# EAGLE design adamonv2 (EAGLE 6.5.0)
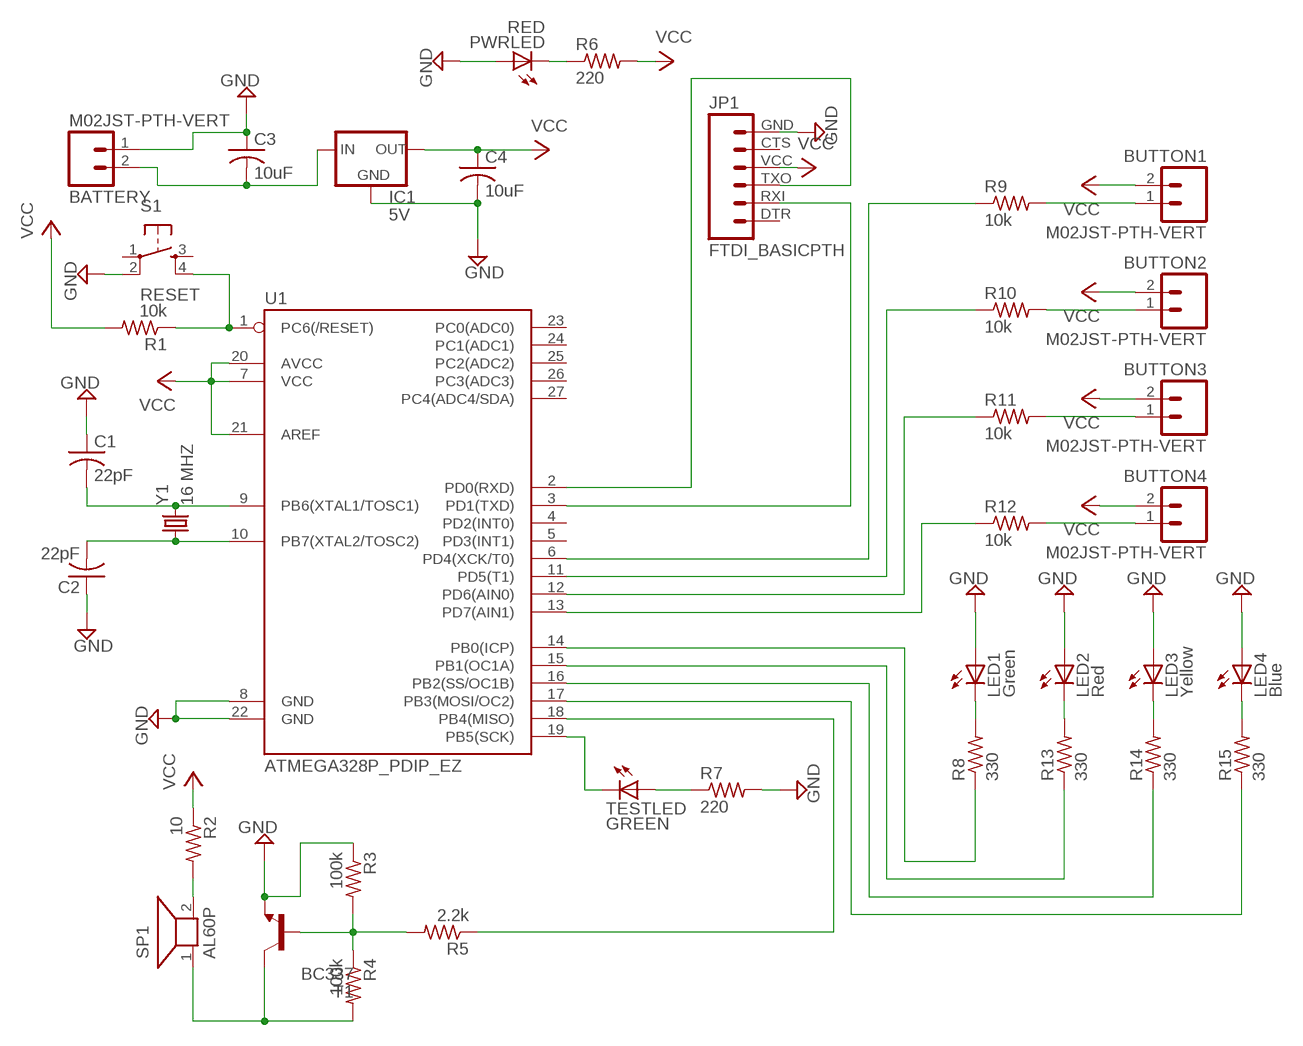
[diagram p0: schematic, sheet 1]

## Parts
BATTERY  M02JST-PTH-VERT  [JST-2-PTH-VERT]
BUTTON1  M02JST-PTH-VERT  [JST-2-PTH-VERT]
BUTTON2  M02JST-PTH-VERT  [JST-2-PTH-VERT]
BUTTON3  M02JST-PTH-VERT  [JST-2-PTH-VERT]
BUTTON4  M02JST-PTH-VERT  [JST-2-PTH-VERT]
C1  22pF  C-USC0805  [C0805]
C2  22pF  C-USC0805  [C0805]
C3  10uF  C-USC0805  [C0805]
C4  10uF  C-USC0805  [C0805]
IC1  5V  V_REG_78XXSINK  [TO220-IGO]
JP1  FTDI_BASICPTH  [FTDI_BASIC]
LED1  Green  LED5MM  [LED5MM]
LED2  Red  LED5MM  [LED5MM]
LED3  Yellow  LED5MM  [LED5MM]
LED4  Blue  LED5MM  [LED5MM]
PWRLED  RED  LEDCHIPLED_0805  [CHIPLED_0805]
R1  10k  R-US_R0805  [R0805]
R2  10  R-US_R0805  [R0805]
R3  100k  R-US_R0805  [R0805]
R4  100k  R-US_R0805  [R0805]
R5  2.2k  R-US_R0805  [R0805]
R6  220  R-US_R0805  [R0805]
R7  220  R-US_R0805  [R0805]
R8  330  R-US_R0805  [R0805]
R9  10k  R-US_R0805  [R0805]
R10  10k  R-US_R0805  [R0805]
R11  10k  R-US_R0805  [R0805]
R12  10k  R-US_R0805  [R0805]
R13  330  R-US_R0805  [R0805]
R14  330  R-US_R0805  [R0805]
R15  330  R-US_R0805  [R0805]
S1  RESET  TAC_SWITCHSMD  [TACTILE_SWITCH_SMD]
SP1  AL60P  [AL60P]
T1  BC337  [TO92]
TESTLED  GREEN  LEDCHIPLED_0805  [CHIPLED_0805]
U1  ATMEGA328P_PDIP_EZ  [DIL28-EZ]
Y1  16 MHZ  CRYSTALHC49US  [HC49US]

## Nets
GND: BATTERY.1 C1.1 C2.1 C3.1 C4.2 IC1.GND JP1.GND LED1.A LED2.A LED3.A LED4.A PWRLED.A R3.1 R7.2 S1.2 T1.1(E) U1.8(GND) U1.22(GND)
N$1: C1.2 U1.9(PB6(XTAL1/TOSC1)) Y1.2
N$2: BATTERY.2 C3.2 IC1.IN
N$4: PWRLED.C R6.1
N$5: R1.1 S1.4 U1.1(PC6(/RESET))
N$6: C2.2 U1.10(PB7(XTAL2/TOSC2)) Y1.1
N$7: TESTLED.C U1.19(PB5(SCK))
N$8: R7.1 TESTLED.A
N$9: JP1.TXO U1.2(PD0(RXD))
N$10: JP1.RXI U1.3(PD1(TXD))
N$11: R15.1 U1.17(PB3(MOSI/OC2))
N$12: R14.1 U1.16(PB2(SS/OC1B))
N$13: R12.1 U1.13(PD7(AIN1))
N$14: BUTTON1.1 R9.2
N$15: R11.1 U1.12(PD6(AIN0))
N$16: BUTTON2.1 R10.2
N$17: R10.1 U1.11(PD5(T1))
N$18: BUTTON3.1 R11.2
N$19: R9.1 U1.6(PD4(XCK/T0))
N$20: BUTTON4.1 R12.2
N$24: R3.2 R4.1 R5.2 T1.2(B)
N$25: R4.2 SP1.1 T1.3(C)
N$26: R2.2 SP1.2
N$31: R5.1 U1.18(PB4(MISO))
N$32: LED4.K(C) R15.2
N$33: LED3.K(C) R14.2
N$34: R13.1 U1.15(PB1(OC1A))
N$35: LED2.K(C) R13.2
N$36: R8.1 U1.14(PB0(ICP))
N$37: LED1.K(C) R8.2
VCC: BUTTON1.2 BUTTON2.2 BUTTON3.2 BUTTON4.2 C4.1 IC1.OUT JP1.VCC R1.2 R2.1 R6.2 U1.7(VCC) U1.20(AVCC) U1.21(AREF)
Unconnected: JP1.CTS JP1.DTR S1.1 S1.3 U1.4(PD2(INT0)) U1.5(PD3(INT1)) U1.23(PC0(ADC0)) U1.24(PC1(ADC1)) U1.25(PC2(ADC2)) U1.26(PC3(ADC3)) U1.27(PC4(ADC4/SDA))

## Library data of the parts
BATTERY BUTTON1-BUTTON4 = SparkFun-Connectors:M02: Standard 2-pin 0.1" header. Use with - straight break away headers ( PRT-00116) - right angle break away headers (PRT-00553) - swiss pins (PRT-00743) - machine pins (PRT-00117) - female headers (PRT-00115) Molex polarized connector foot print use with: PRT-08233 with associated crimp pins and housings. 2.54_SCREWTERM for use with PRT-10571. 3.5mm Screw Terminal footprints for PRT-08084 5mm Screw Terminal footprints for use with PRT-08433
C1-C4 = resistor:C-US: CAPACITOR, American symbol
IC1 = SparkFun-PowerIC:V_REG_78XX: Voltage Regulator Standard 7805 5V regulator. IGO (Input Ground Output). Spark Fun Electronics SKU : COM-00107
JP1 = SparkFun-Connectors:FTDI_BASIC: FTDI Basic header with labels
LED1-LED4 = SparkFun-LED:LED: LEDs Standard schematic elements and footprints for 5mm, 3mm, 1206, and 0603 sized LEDs. 5mm - Spark Fun Electronics SKU : COM-00529 (and others)
PWRLED TESTLED = led:LED: LED OSRAM: - CHIPLED LG R971, LG N971, LY N971, LG Q971, LY Q971, LO R971, LY R971 LH N974, LH R974 LS Q976, LO Q976, LY Q976 LO Q996 - Hyper CHIPLED LW Q18S LB Q993, LB Q99A, LB R99A - SideLED LS A670, LO A670, LY A670, LG A670, LP A670 LB A673, LV A673, LT A673, LW A673 LH A674 LY A675 LS A676, LA A676, LO A676, LY A676, LW A676 LS A679, LY A679, LG A679 - Hyper Micro SIDELED® LS Y876, LA Y876, LO Y876, LY Y876 LT Y87S - SmartLED LW L88C, LW L88S LB L89C, LB L89S, LG L890 LS L89K, LO L89K, LY L89K LS L896, LA L896, LO L896, LY L896 - TOPLED LS T670, LO T670, LY T670, LG T670, LP T670 LSG T670, LSP T670, LSY T670, LOP T670, LYG T670 LG T671, LOG T671, LSG T671 LB T673, LV T673, LT T673, LW T673 LH T674 LS T676, LA T676, LO T676, LY T676, LB T676, LH T676, LSB T676, LW T676 LB T67C, LV T67C, LT T67C, LS T67K, LO T67K, LY T67K, LW E67C LS E67B, LA E67B, LO E67B, LY E67B, LB E67C, LV E67C, LT E67C LW T67C LS T679, LY T679, LG T679 LS T770, LO T770, LY T770, LG T770, LP T770 LB T773, LV T773, LT T773, LW T773 LH T774 LS E675, LA E675, LY E675, LS T675 LS T776, LA T776, LO T776, LY T776, LB T776 LHGB T686 LT T68C, LB T68C - Hyper Mini TOPLED® LB M676 - Mini TOPLED Santana® LG M470 LS M47K, LO M47K, LY M47K Source: http://www.osram.convergy.de LUXEON: - LUMILED® LXK2-PW12-R00, LXK2-PW12-S00, LXK2-PW14-U00, LXK2-PW14-V00 LXK2-PM12-R00, LXK2-PM12-S00, LXK2-PM14-U00 LXK2-PE12-Q00, LXK2-PE12-R00, LXK2-PE12-S00, LXK2-PE14-T00, LXK2-PE14-U00 LXK2-PB12-K00, LXK2-PB12-L00, LXK2-PB12-M00, LXK2-PB14-N00, LXK2-PB14-P00, LXK2-PB14-Q00 LXK2-PR12-L00, LXK2-PR12-M00, LXK2-PR14-Q00, LXK2-PR14-R00 LXK2-PD12-Q00, LXK2-PD12-R00, LXK2-PD12-S00 LXK2-PH12-R00, LXK2-PH12-S00 LXK2-PL12-P00, LXK2-PL12-Q00, LXK2-PL12-R00 Source: www.luxeon.com KINGBRIGHT: KA-3528ASYC Source: www.kingbright.com
R1 R6 R7 = resistor:R-US_: RESISTOR, American symbol
R2-R5 R8-R15 = rcl:R-US_: RESISTOR, American symbol
S1 = SparkFun-Electromechanical:TAC_SWITCH: Momentary Switch Button commonly used for reset or general input. Spark Fun Electronics SKU : COM-00097 SMT- SWCH-08247; PROD_ID: SWCH-08247
SP1 = buzzer:AL60P: SPEAKER Source: Buerklin; OC_FARNELL: unknown; OC_NEWARK: unknown
T1 = transistor:BC337: NPN TRANSISTOR
U1 = SparkFun-DigitalIC:ATMEGA328P_PDIP_EZ: uC used in the Arduino 32kb flash, 1k EEPROM, 2k SRAM This is the through-hole version of this chip.
Y1 = SparkFun-FreqCtrl:CRYSTAL: Various standard crystals. Proven footprints. Spark Fun Electronics SKU : COM-00534

## Board
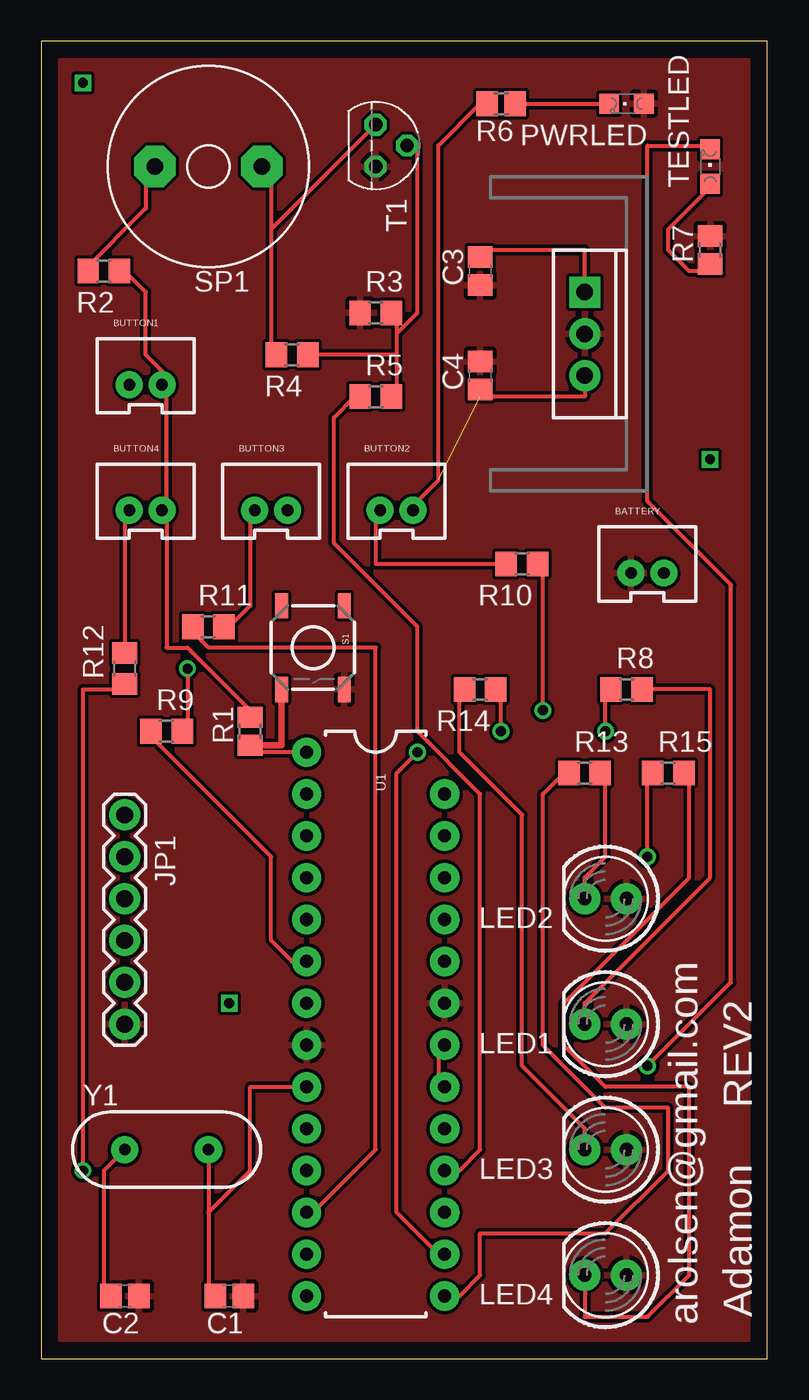
[diagram p1: board, top side]
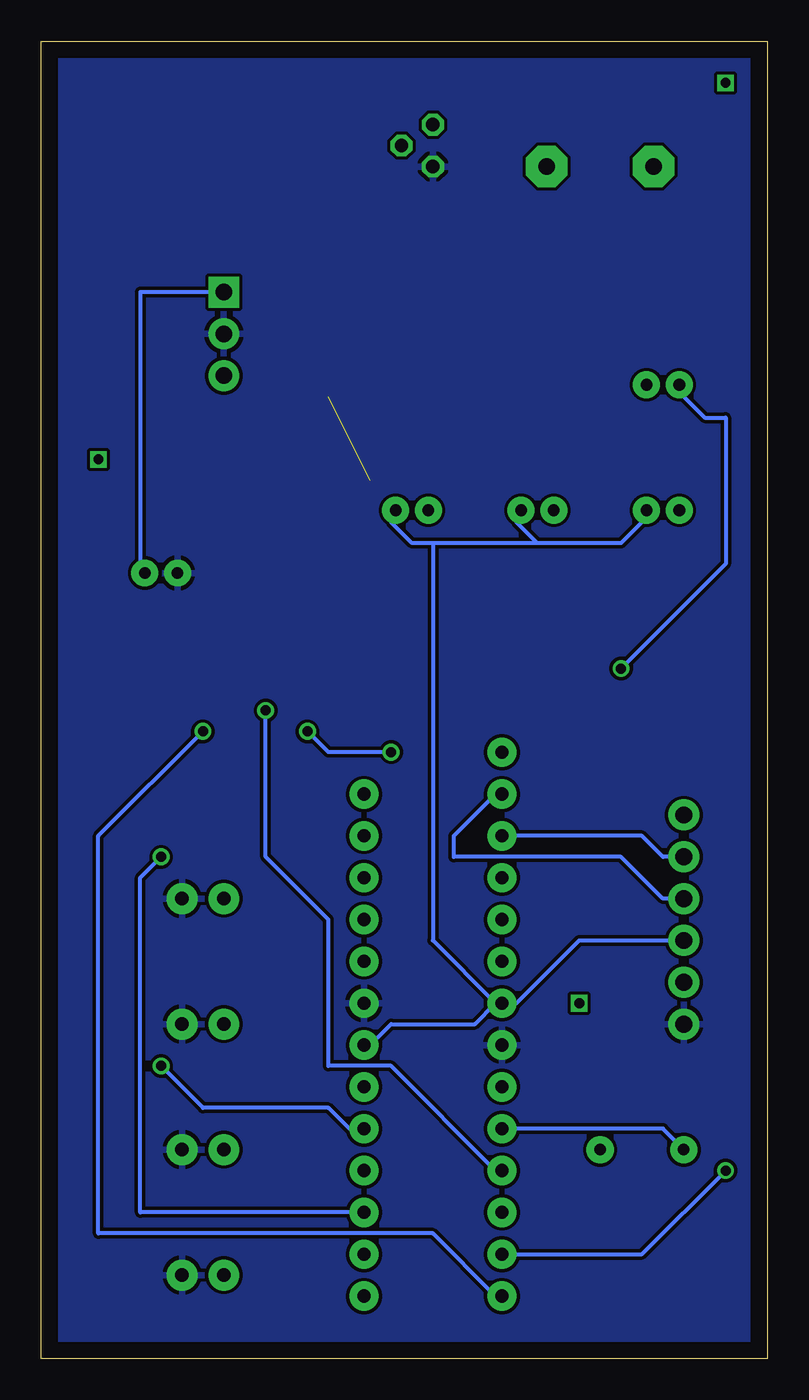
[diagram p2: board, bottom side, seen from below]

Size 44.12 x 80 mm. Coordinates in mm from the lower left corner, seen from the top.
Outline: 0,0 44.12,0 44.12,80 0,80 0,0
Copper layers (1*16): Top 0.035mm / dielectric 1.5mm / Bottom 0.035mm
Design rules "default": minimum track width 10mil, minimum drill 24mil, track to track 8mil, track to pad 8mil, pad to pad 8mil, via to via 8mil, smd to smd 8mil, copper to edge 40mil, drill to drill 8mil, minimum pad ring 10mil, minimum via ring 8mil, stop-mask expansion 4mil, vias tented up to drill 0mil, thermal gap 10mil

### Footprints (pad centres in the part's own frame; a part is rotated, then mirrored left to right if it is on the bottom)
JST-2-PTH-VERT = drill 0.7 pad 1.626: 1 -1,-0.55; 2 1,-0.55
C0805 = smd 1.3 x 1.5: 1 -0.85,0; 2 0.85,0
TO220-IGO = drill 1 pad 1.88: GND 0,0; OUT 2.54,0 | drill 1 pad 1.88 square: IN -2.54,0
FTDI_BASIC = drill 1.016 pad 1.88: CTS 10.16,0; DTR 0,0; GND 12.7,0; RXI 2.54,0; TXO 5.08,0; VCC 7.62,0
LED5MM = drill 0.813 pad 1.88: A -1.27,0; K 1.27,0
CHIPLED_0805 = smd 1.2 x 1.2: A 0,-1.05; C 0,1.05
R0805 = smd 1.3 x 1.5: 1 -0.85,0; 2 0.85,0
R0805' = smd 1.3 x 1.5: 1 -0.95,0; 2 0.95,0
TACTILE_SWITCH_SMD = smd 1.524 x 0.762: 1 -2.54,1.905; 2 2.54,1.905; 3 -2.54,-1.905; 4 2.54,-1.905
AL60P = drill 1.016 pad 2.54 octagon: 1 -3.251,0; 2 3.251,0
TO92 = drill 0.813 octagon: 1 1.27,0; 2 0,1.905; 3 -1.27,0
DIL28-EZ = drill 0.8 pad 1.778: 1 -16.51,-4.191; 2 -13.97,-4.191; 3 -11.43,-4.191; 4 -8.89,-4.191; 5 -6.35,-4.191; 6 -3.81,-4.191; 7 -1.27,-4.191; 8 1.27,-4.191; 9 3.81,-4.191; 10 6.35,-4.191; 11 8.89,-4.191; 12 11.43,-4.191; 13 13.97,-4.191; 14 16.51,-4.191; 15 16.51,4.191; 16 13.97,4.191; 17 11.43,4.191; 18 8.89,4.191; 19 6.35,4.191; 20 3.81,4.191; 21 1.27,4.191; 22 -1.27,4.191; 23 -3.81,4.191; 24 -6.35,4.191; 25 -8.89,4.191; 26 -11.43,4.191; 27 -13.97,4.191
HC49US = drill 0.7 pad 1.651: 1 -2.54,0; 2 2.54,0

### Placement (x,y rotation side)
BATTERY  36.83,48.26 0 top
BUTTON1  6.35,59.69 0 top
BUTTON2  21.59,52.07 0 top
BUTTON3  13.97,52.07 0 top
BUTTON4  6.35,52.07 0 top
C1  11.43,3.81 180 top
C2  5.08,3.81 180 top
C3  26.67,66.04 90 top
C4  26.67,59.69 90 top
IC1  33.02,62.23 270 top
JP1  5.08,33.02 270 top
LED1  34.29,20.32 180 top
LED2  34.29,27.94 180 top
LED3  34.29,12.7 180 top
LED4  34.29,5.08 180 top
PWRLED  35.56,76.2 90 top
R1  12.7,38.1 90 top
R2  10  [R0805']  3.81,66.04 180 top
R3  100k  [R0805']  20.32,63.5 0 top
R4  100k  [R0805']  15.24,60.96 180 top
R5  2.2k  [R0805']  20.32,58.42 0 top
R6  27.94,76.2 180 top
R7  40.64,67.31 90 top
R8  330  [R0805']  35.56,40.64 0 top
R9  10k  [R0805']  7.62,38.1 0 top
R10  10k  [R0805']  29.21,48.26 180 top
R11  10k  [R0805']  10.16,44.45 0 top
R12  10k  [R0805']  5.08,41.91 90 top
R13  330  [R0805']  33.02,35.56 0 top
R14  330  [R0805']  26.67,40.64 180 top
R15  330  [R0805']  38.1,35.56 0 top
S1  16.51,43.18 270 top
SP1  10.16,72.39 180 top
T1  20.32,73.66 270 top
TESTLED  40.64,72.39 0 top
U1  20.32,20.32 270 top
Y1  7.62,12.7 0 top

### Tracks (layer width: path | path; a pad name or v marks a point on that pad's centre or on a via)
GND
  pour Top: 0,80.01 0,0 44.45,0 44.45,80.01
  pour Bottom: 0,80.01 44.45,80.01 44.45,0 0,0
N$1
  Top 0.254: Y1.2 10.16,8.89 | 10.16,8.89 10.16,3.81 C1.2 | 10.16,8.89 12.7,11.43 12.7,16.51 U1.9 16.51,16.51
N$2
  Top 0.254: IC1.IN 33.02,67.31 26.67,67.31 C3.2
  Bottom 0.254: IC1.IN 38.1,64.77 38.1,48.26 BATTERY.2
N$4
  Top 0.254: R6.1 PWRLED.C
N$5
  Top 0.254: R1.1 12.7,36.83 U1.1 16.51,36.83
  Top 0.406: R1.1 14.61,37.25 S1.4
N$6
  Top 0.254: Y1.1 3.81,11.43 3.81,3.81 C2.2
  Bottom 0.254: Y1.1 6.35,13.97 U1.10 16.51,13.97
N$7  (via drill 0.61)
  Top 0.254: v36.83,17.78 41.91,22.86 41.91,46.99 36.83,52.07 36.83,73.66 40.64,73.66 TESTLED.C
  Bottom 0.254: v36.83,17.78 34.29,15.24 26.67,15.24 25.4,13.97 U1.19 24.13,13.97
N$8
  Top 0.254: TESTLED.A 40.64,71.12 38.1,68.58 38.1,67.31 39.37,66.04 40.64,66.04 R7.1
N$9
  Bottom 0.254: JP1.TXO 6.35,27.94 8.89,30.48 19.05,30.48 19.05,31.75 16.51,34.29 U1.2
N$10
  Bottom 0.254: JP1.RXI 6.35,30.48 7.62,31.75 U1.3 16.51,31.75
N$11  (via drill 0.61)
  Top 0.254: v36.83,30.48 36.83,35.56 R15.1
  Bottom 0.254: v36.83,30.48 38.1,29.21 38.1,8.89 U1.17 24.13,8.89
N$12  (via drill 0.61)
  Top 0.254: v27.94,38.1 27.94,40.64 R14.1 | v22.86,36.83 21.59,35.56 21.59,8.89 24.13,6.35 U1.16
  Bottom 0.254: v27.94,38.1 26.67,36.83 v22.86,36.83
N$13  (via drill 0.61)
  Top 0.254: v2.54,11.43 2.54,40.64 5.08,40.64 R12.1
  Bottom 0.254: v2.54,11.43 7.62,6.35 U1.13 16.51,6.35
N$14  (via drill 0.61)
  Top 0.254: v8.89,41.91 8.89,38.1 R9.2
  Bottom 0.254: v8.89,41.91 2.54,48.26 2.54,57.15 3.81,57.15 5.08,58.42 BUTTON1.1
N$15
  Top 0.254: R11.1 8.89,44.45 10.16,43.18 20.32,43.18 20.32,12.7 16.51,8.89 U1.12
N$16
  Top 0.254: R10.2 20.32,48.26 20.32,50.8 BUTTON2.1
N$17  (via drill 0.61)
  Top 0.254: v30.48,39.37 30.48,48.26 R10.1
  Bottom 0.254: v30.48,39.37 30.48,30.48 26.67,26.67 26.67,17.78 22.86,17.78 16.51,11.43 U1.11
N$18
  Top 0.254: R11.2 11.43,44.45 12.7,45.72 12.7,50.8 BUTTON3.1
N$19
  Top 0.254: R9.1 6.35,38.1 13.97,30.48 13.97,25.4 15.24,24.13 U1.6 16.51,24.13
N$20
  Top 0.254: R12.2 5.08,50.8 BUTTON4.1
N$21  (via drill 0.6)
  other vias: 11.43,21.59
N$22  (via drill 0.6)
  other vias: 2.54,77.47
N$23  (via drill 0.6)
  other vias: 40.64,54.61
N$24
  Top 0.254: 21.59,62.23 21.59,63.5 R3.2 | 21.59,62.23 21.59,60.96 | 21.59,60.96 21.59,58.42 R5.2 | 21.59,60.96 R4.1 | 21.59,62.23 22.86,63.5 22.86,73.66 T1.2
N$25
  Top 0.254: 13.97,68.58 13.97,72.39 SP1.1 | 13.97,68.58 13.97,60.96 R4.2 | 13.97,68.58 T1.3
N$26
  Top 0.254: R2.2 2.54,66.04 6.35,69.85 6.35,72.39 SP1.2
N$31
  Top 0.254: R5.1 19.05,58.42 17.78,57.15 17.78,49.53 22.86,44.45 22.86,38.1 26.67,34.29 26.67,12.7 25.4,11.43 U1.18 24.13,11.43
N$32
  Top 0.254: LED4.K 33.02,2.54 36.83,2.54 39.37,5.08 39.37,16.51 34.29,16.51 31.75,19.05 31.75,21.59 39.37,29.21 39.37,35.56 R15.2
N$33
  Top 0.254: LED3.K 33.02,13.97 29.21,17.78 29.21,33.02 25.4,36.83 25.4,40.64 R14.2
N$34
  Top 0.254: R13.1 31.75,35.56 30.48,34.29 30.48,19.05 34.29,15.24 38.1,15.24 38.1,11.43 34.29,7.62 26.67,7.62 26.67,5.08 25.4,3.81 U1.15 24.13,3.81
N$35
  Top 0.254: LED2.K 33.02,29.21 34.29,30.48 34.29,35.56 R13.2
N$36  (via drill 0.61)
  Top 0.254: v34.29,38.1 34.29,40.64 R8.1
  Bottom 0.254: v34.29,38.1 40.64,31.75 40.64,7.62 20.32,7.62 16.51,3.81 U1.14
N$37
  Top 0.254: R8.2 40.64,40.64 40.64,29.21 33.02,21.59 LED1.K
VCC  (1 unrouted)
  Top 0.254: U1.20 24.13,16.51 24.13,19.05 U1.21 | R6.2 26.67,76.2 24.13,73.66 24.13,53.34 22.86,52.07 BUTTON2.2 | R2.1 5.08,66.04 6.35,64.77 6.35,60.96 7.62,59.69 BUTTON1.2 7.62,58.42 7.62,52.07 BUTTON4.2 7.62,50.8 7.62,43.18 8.89,43.18 12.7,39.37 R1.2 | IC1.OUT 33.02,58.42 26.67,58.42 C4.1
  Bottom 0.254: 16.51,21.59 17.78,20.32 22.86,20.32 24.13,19.05 U1.21 | JP1.VCC 11.43,25.4 15.24,21.59 U1.7 16.51,21.59 | 13.97,49.53 15.24,50.8 BUTTON3.2 | 13.97,49.53 8.89,49.53 7.62,50.8 BUTTON4.2 | 13.97,49.53 20.32,49.53 | 20.32,49.53 21.59,49.53 22.86,50.8 BUTTON2.2 | 16.51,21.59 20.32,25.4 20.32,49.53

### Text on the board
tPlace: arolsen@gmail.com | REV2 | Adamon